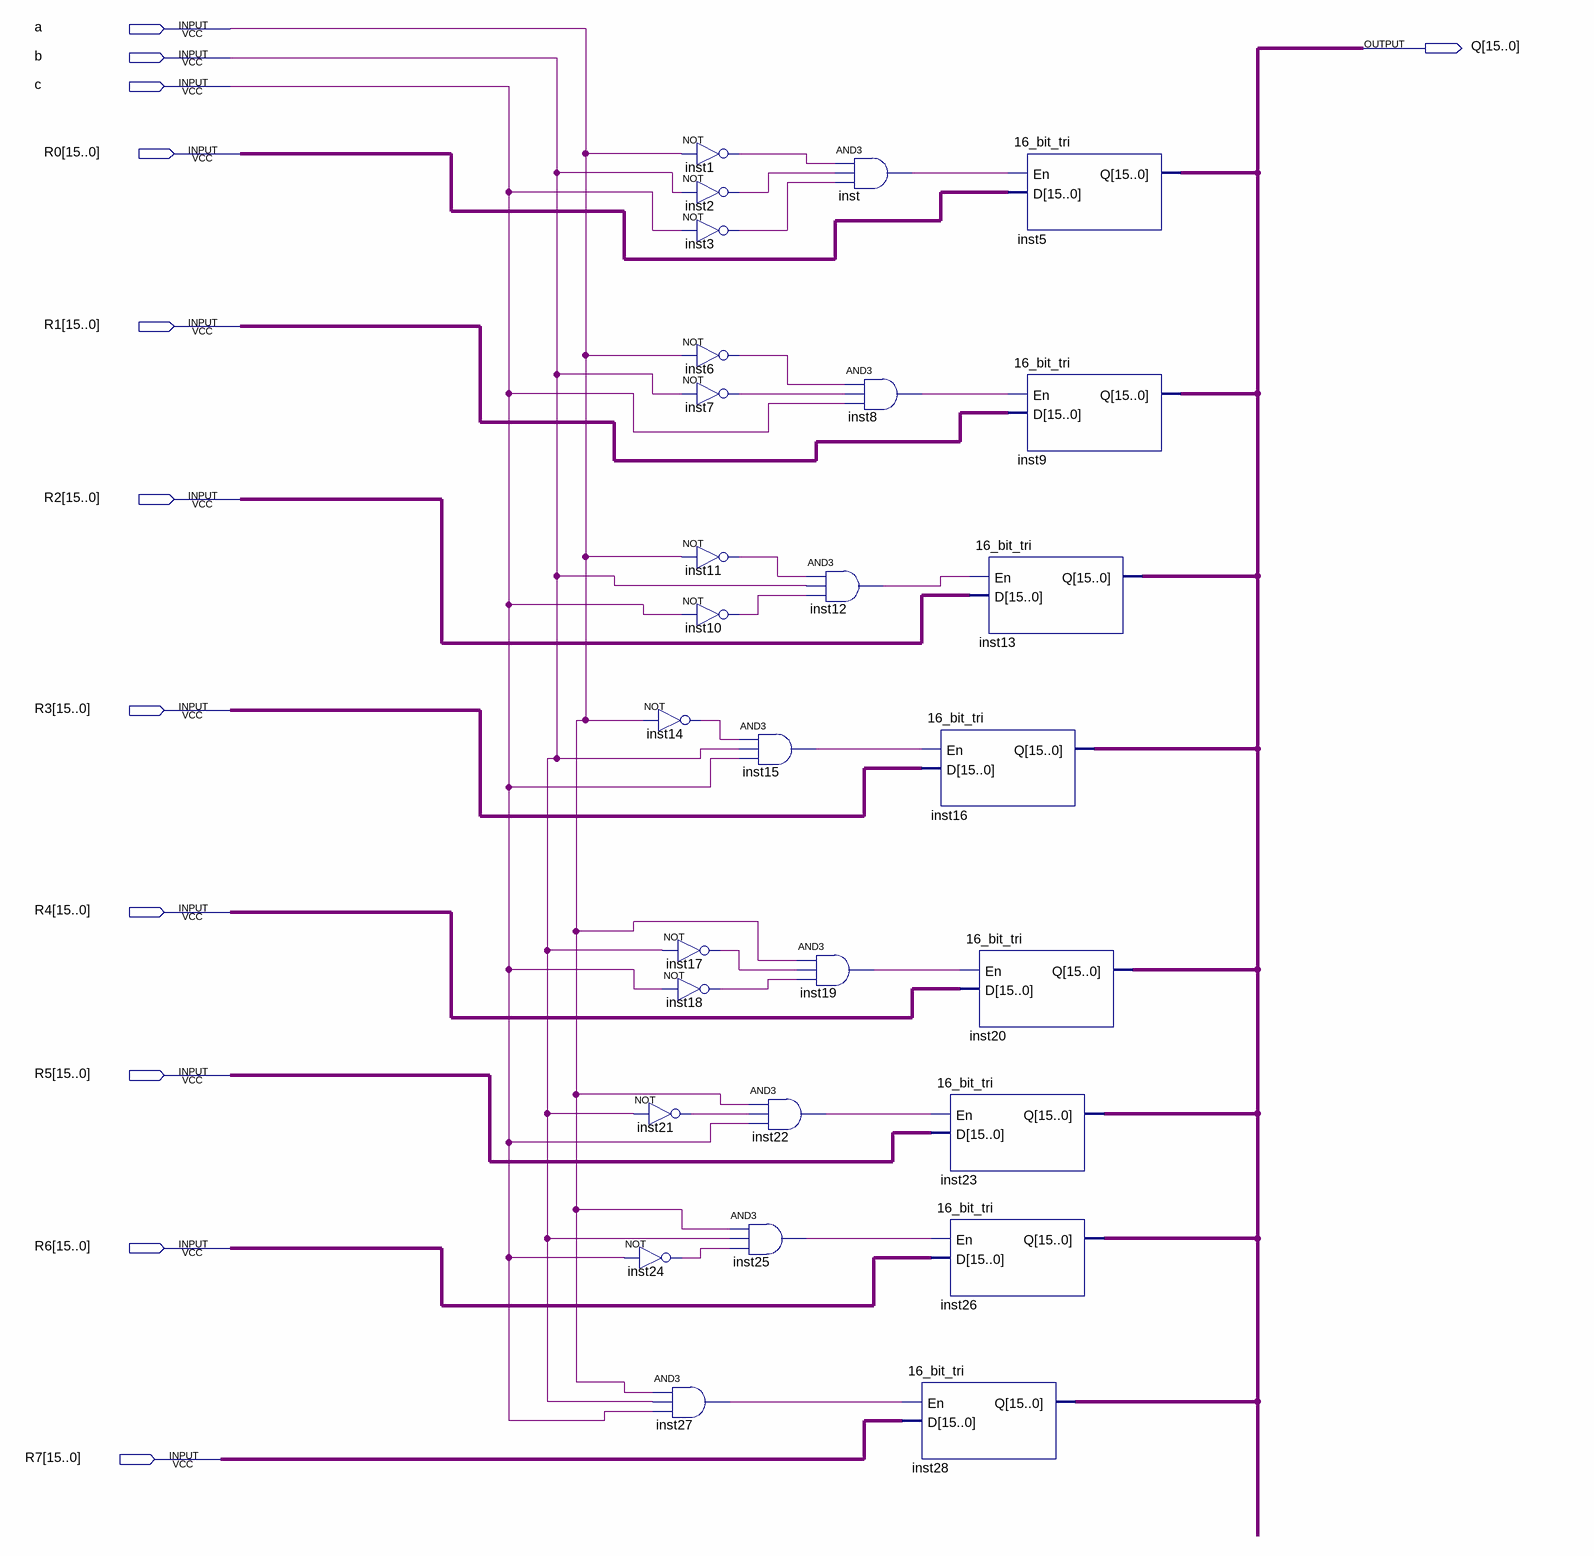
[diagram p0: schematic sheet]
// Quartus schematic 16_bit_8_to_1_MUX.bdf as structural Verilog: 28 symbols, 12 pins
module \16_bit_8_to_1_MUX  (
  input  a,
  input  b,
  input  c,
  input  [15:0] R0,
  input  [15:0] R1,
  input  [15:0] R2,
  input  [15:0] R3,
  input  [15:0] R4,
  input  [15:0] R5,
  input  [15:0] R6,
  input  [15:0] R7,
  output [15:0] Q
);

  wire inst1_out, inst2_out, inst3_out, inst6_out, inst7_out, inst8_out, inst10_out, inst11_out, inst12_out,
       inst14_out, inst15_out, inst17_out, inst18_out, inst19_out, inst21_out, inst22_out, inst24_out,
       inst25_out, inst27_out, inst_out;

  not inst21 (inst21_out, b);
  not inst24 (inst24_out, c);
  not inst1 (inst1_out, a);
  not inst2 (inst2_out, b);
  not inst3 (inst3_out, c);
  not inst6 (inst6_out, a);
  not inst7 (inst7_out, b);
  not inst11 (inst11_out, a);
  not inst10 (inst10_out, c);
  not inst14 (inst14_out, a);
  not inst17 (inst17_out, b);
  not inst18 (inst18_out, c);
  and inst27 (inst27_out, a, b, c);
  and inst15 (inst15_out, inst14_out, b, c);
  and inst22 (inst22_out, a, inst21_out, c);
  and inst25 (inst25_out, a, b, inst24_out);
  and inst (inst_out, inst1_out, inst2_out, inst3_out);
  and inst8 (inst8_out, inst6_out, inst7_out, c);
  and inst12 (inst12_out, inst11_out, b, inst10_out);
  and inst19 (inst19_out, a, inst17_out, inst18_out);
  \16_bit_tri  inst16 (.En(inst15_out), .D(R3), .Q(Q));
  \16_bit_tri  inst23 (.En(inst22_out), .D(R5), .Q(Q));
  \16_bit_tri  inst26 (.En(inst25_out), .D(R6), .Q(Q));
  \16_bit_tri  inst28 (.En(inst27_out), .D(R7), .Q(Q));
  \16_bit_tri  inst5 (.En(inst_out), .D(R0), .Q(Q));
  \16_bit_tri  inst9 (.En(inst8_out), .D(R1), .Q(Q));
  \16_bit_tri  inst13 (.En(inst12_out), .D(R2), .Q(Q));
  \16_bit_tri  inst20 (.En(inst19_out), .D(R4), .Q(Q));
endmodule
